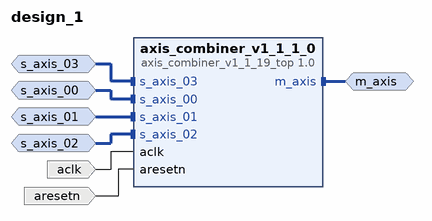
[diagram p0: block diagram of the top level]
# Vivado block design design_1, xc7z007sclg400-1, Vivado 2020.1
create_bd_design design_1

create_bd_intf_port -mode Slave -vlnv xilinx.com:interface:axis_rtl:1.0 s_axis_00
set_property -dict [list \
  CONFIG.TDATA_NUM_BYTES 1 \
  CONFIG.TDEST_WIDTH 0 \
  CONFIG.TID_WIDTH 0 \
  CONFIG.TUSER_WIDTH 0 \
  CONFIG.HAS_TREADY 1 \
  CONFIG.HAS_TSTRB 0 \
  CONFIG.HAS_TKEEP 0 \
  CONFIG.HAS_TLAST 0 \
  CONFIG.LAYERED_METADATA undef \
] [get_bd_intf_ports s_axis_00]
create_bd_intf_port -mode Slave -vlnv xilinx.com:interface:axis_rtl:1.0 s_axis_01
set_property -dict [list \
  CONFIG.TDATA_NUM_BYTES 1 \
  CONFIG.TDEST_WIDTH 0 \
  CONFIG.TID_WIDTH 0 \
  CONFIG.TUSER_WIDTH 0 \
  CONFIG.HAS_TREADY 1 \
  CONFIG.HAS_TSTRB 0 \
  CONFIG.HAS_TKEEP 0 \
  CONFIG.HAS_TLAST 0 \
  CONFIG.LAYERED_METADATA undef \
] [get_bd_intf_ports s_axis_01]
create_bd_intf_port -mode Slave -vlnv xilinx.com:interface:axis_rtl:1.0 s_axis_02
set_property -dict [list \
  CONFIG.TDATA_NUM_BYTES 1 \
  CONFIG.TDEST_WIDTH 0 \
  CONFIG.TID_WIDTH 0 \
  CONFIG.TUSER_WIDTH 0 \
  CONFIG.HAS_TREADY 1 \
  CONFIG.HAS_TSTRB 0 \
  CONFIG.HAS_TKEEP 0 \
  CONFIG.HAS_TLAST 0 \
  CONFIG.LAYERED_METADATA undef \
] [get_bd_intf_ports s_axis_02]
create_bd_intf_port -mode Slave -vlnv xilinx.com:interface:axis_rtl:1.0 s_axis_03
set_property -dict [list \
  CONFIG.TDATA_NUM_BYTES 1 \
  CONFIG.TDEST_WIDTH 0 \
  CONFIG.TID_WIDTH 0 \
  CONFIG.TUSER_WIDTH 0 \
  CONFIG.HAS_TREADY 1 \
  CONFIG.HAS_TSTRB 0 \
  CONFIG.HAS_TKEEP 0 \
  CONFIG.HAS_TLAST 0 \
  CONFIG.LAYERED_METADATA undef \
] [get_bd_intf_ports s_axis_03]
create_bd_intf_port -mode Master -vlnv xilinx.com:interface:axis_rtl:1.0 m_axis
create_bd_port -dir I -type clk aclk
set_property -dict {CONFIG.FREQ_HZ 100000000} [get_bd_ports aclk]
create_bd_port -dir I -type rst aresetn

create_bd_cell -type ip -vlnv user.org:user:axis_combiner_v1_1_19_top:1.0 axis_combiner_v1_1_1_0
set_property -dict {CONFIG.C_AXIS_TDATA_WIDTH 8 CONFIG.C_NUM_SI_SLOTS 4} [get_bd_cells axis_combiner_v1_1_1_0]

# ---- connections ----

connect_bd_intf_net -intf_net s_axis_03_1 [get_bd_intf_ports s_axis_03] [get_bd_intf_pins axis_combiner_v1_1_1_0/s_axis_03]
connect_bd_intf_net [get_bd_intf_ports m_axis] [get_bd_intf_pins axis_combiner_v1_1_1_0/m_axis]
connect_bd_intf_net -intf_net s_axis_00_1 [get_bd_intf_ports s_axis_00] [get_bd_intf_pins axis_combiner_v1_1_1_0/s_axis_00]
connect_bd_intf_net -intf_net s_axis_01_1 [get_bd_intf_ports s_axis_01] [get_bd_intf_pins axis_combiner_v1_1_1_0/s_axis_01]
connect_bd_intf_net -intf_net s_axis_02_1 [get_bd_intf_ports s_axis_02] [get_bd_intf_pins axis_combiner_v1_1_1_0/s_axis_02]
connect_bd_net [get_bd_ports aclk] [get_bd_pins axis_combiner_v1_1_1_0/aclk]
connect_bd_net [get_bd_ports aresetn] [get_bd_pins axis_combiner_v1_1_1_0/aresetn]

validate_bd_design
save_bd_design
